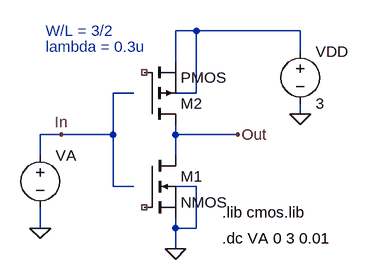
[diagram p0: schematic inv-treshold.asc]
inv-treshold.asc, the LTspice schematic file:
Version 4
SHEET 1 1292 680
WIRE -592 -96 -624 -96
WIRE -432 -96 -592 -96
WIRE -432 -64 -432 -96
WIRE -624 -48 -624 -96
WIRE -688 0 -720 0
WIRE -592 0 -592 -96
WIRE -592 0 -624 0
WIRE -432 32 -432 16
WIRE -800 64 -832 64
WIRE -720 64 -720 0
WIRE -720 64 -800 64
WIRE -624 64 -624 48
WIRE -528 64 -624 64
WIRE -832 96 -832 64
WIRE -624 96 -624 64
WIRE -720 144 -720 64
WIRE -688 144 -720 144
WIRE -592 144 -624 144
WIRE -832 208 -832 176
WIRE -624 208 -624 192
WIRE -592 208 -592 144
WIRE -592 208 -624 208
WIRE -624 240 -624 208
FLAG -624 240 0
FLAG -432 32 0
FLAG -800 64 In
FLAG -528 64 Out
FLAG -832 208 0
SYMBOL voltage -432 -80 R0
WINDOW 123 0 0 Left 2
WINDOW 39 0 0 Left 2
SYMATTR InstName VDD
SYMATTR Value 3
SYMBOL voltage -832 80 R0
WINDOW 123 0 0 Left 2
WINDOW 39 0 0 Left 2
SYMATTR InstName VA
SYMATTR Value ""
SYMBOL pmos -672 48 M180
WINDOW 39 56 100 Left 2
WINDOW 40 56 128 Left 2
SYMATTR InstName M2
SYMATTR Value2 l=0.6u w=0.9u
SYMATTR SpiceModel ""
SYMATTR Value PMOS
SYMBOL nmos -672 96 R0
SYMATTR InstName M1
SYMATTR Value2 l=0.6u w=0.9u
SYMATTR Value NMOS
TEXT -552 184 Left 2 !.lib cmos.lib
TEXT -552 224 Left 2 !.dc VA 0 3 0.01
TEXT -824 -96 Left 2 ;W/L = 3/2
TEXT -824 -72 Left 2 ;lambda = 0.3u

The netlist it stands for:
* inv-treshold.asc
VDD N001 0 3
VA In 0
* M2: PMOS l=0.6u w=0.9u (symbol pmos not certain, pin order unknown); nets seen at it: N001, Out
* M1: NMOS l=0.6u w=0.9u (symbol nmos not certain, pin order unknown); nets seen at it: 0, Out
.lib cmos.lib
.dc VA 0 3 0.01
* W/L = 3/2
* lambda = 0.3u
.backanno
.end